# EAGLE design control_prg_03_12_2018 (EAGLE 6.6.0)
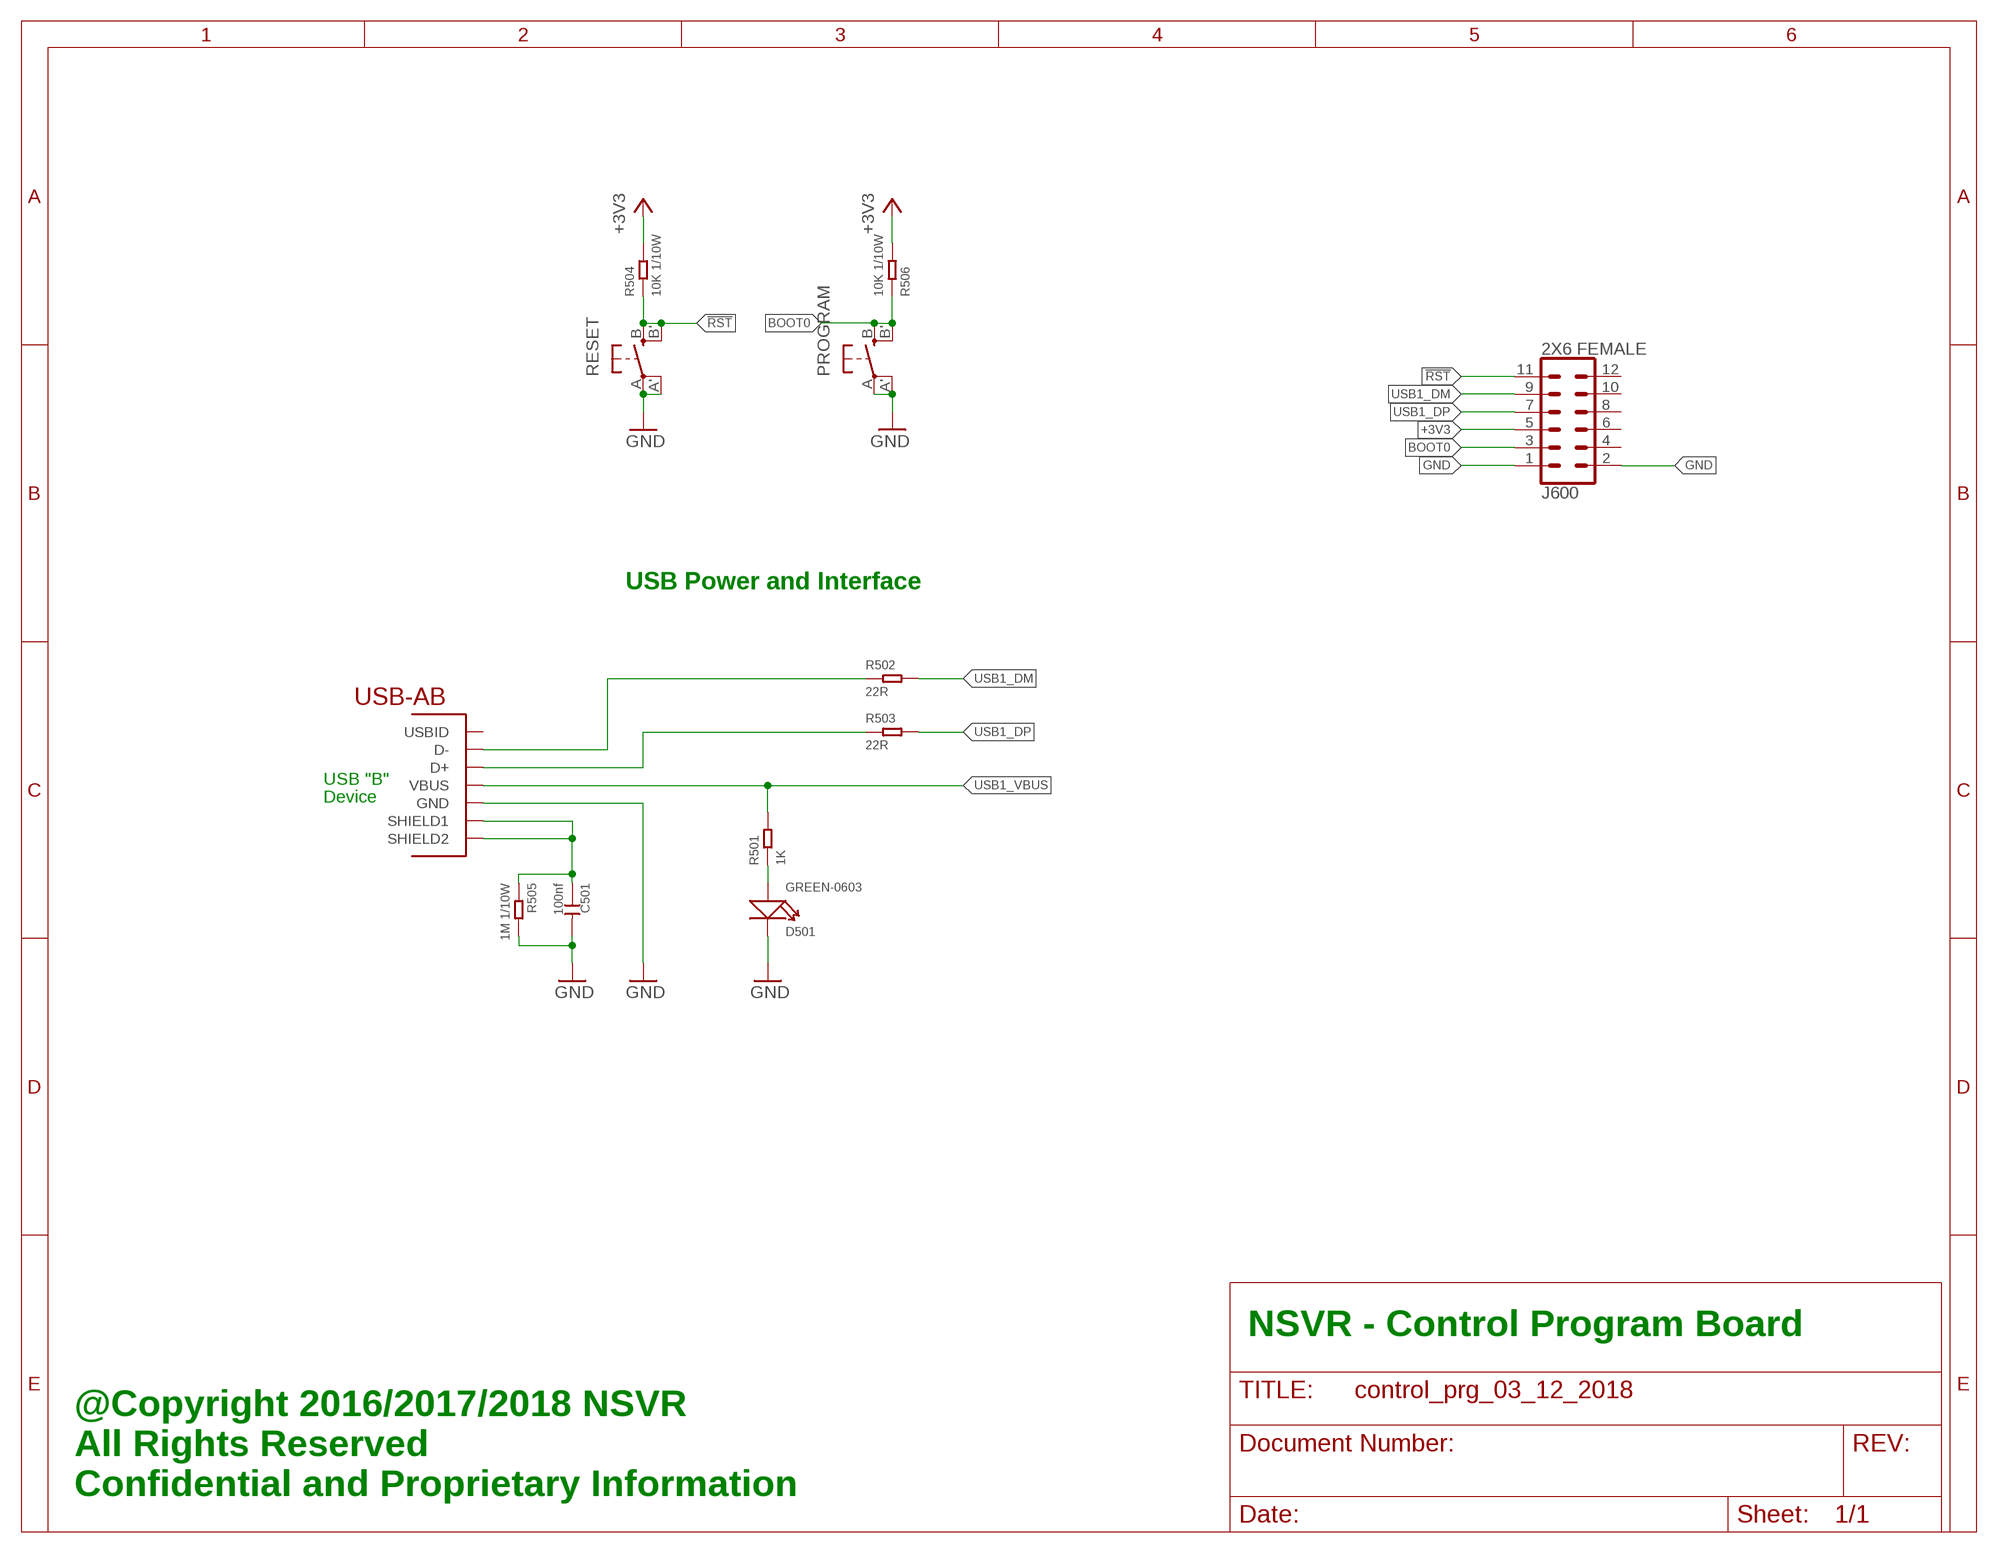
[diagram p0: schematic, sheet 1]

## Parts
C501  100nf  CERAMIC-100NF-50V-10%-X7R(0603)  [C0603]
D501  GREEN-0603  SMD-LED-CLEAR-GREEN(0603)  [LED-0603]
J600  2X6 FEMALE  CONN_06X2PTH_FEMALE  [2X6]
PROGRAM  EVQQ2  [EVQ-Q2]
R501  1K  SMD-RES-1K-1%-1/10W(0603)  [R0603]
R502  22R  SMD-RES-22R-5%-1/10W(0603)  [R0603]
R503  22R  SMD-RES-22R-5%-1/10W(0603)  [R0603]
R504  10K 1/10W  SMD-RES-10K-5%-1/10W(0603)  [R0603]
R505  1M 1/10W  SMD-RES-1M-5%-1/10W(0603)  [R0603]
R506  10K 1/10W  SMD-RES-10K-5%-1/10W(0603)  [R0603]
RESET  EVQQ2  [EVQ-Q2]
USB501  USB_AB  [USB-AB-MICRO-SMD]

## Nets
!RST: J600.11 R504.1 RESET.B'(S1) RESET.B(S)
+3V3: J600.5 R504.2 R506.2
BOOT0: J600.3 PROGRAM.B'(S1) PROGRAM.B(S) R506.1
GND: C501.2 D501.- J600.1 J600.2 PROGRAM.A'(P1) PROGRAM.A(P) R505.2 RESET.A'(P1) RESET.A(P) USB501.GND
LED1: D501.+ R501.1
USB1_DM: J600.9 R502.2
USB1_DP: J600.7 R503.2
USB1_M: R502.1 USB501.D-
USB1_P: R503.1 USB501.D+
USB1_SHIELD: C501.1 R505.1 USB501.SHIELD1 USB501.SHIELD2
USB1_VBUS: R501.2 USB501.VBUS
Unconnected: J600.4 J600.6 J600.8 J600.10 J600.12 USB501.ID(USBID)

## Notes on the sheet
- USB Power and Interface
- USB "B"
- Device
- NSVR - Control Program Board
- @Copyright 2016/2017/2018 NSVR
  All Rights Reserved
  Confidential and Proprietary Information

## Library data of the parts
C501 = Seeed-Capacitor-2016:CERAMIC-100NF-50V-10%-X7R(0603): 302010138; MPN: CC0603KRX7R9BB104
D501 = Seeed-LED-2016:SMD-LED-CLEAR-GREEN(0603): 304090043; MPN: 19-217-G7C-AN1P2-3T
J600 = SparkFun-Connectors:CONN_06X2: Multi connection point. Often used as Generic Header-pin footprint for 0.1 inch spaced/style header connections On any of the 0.1 inch spaced packages, you can populate with these: Break Away Headers - Straight <https://www.sparkfun.com/products/116> (PRT-00116) Break Away Male Headers - Right Angle <https://www.sparkfun.com/products/553> (PRT-00553) Female Headers <https://www.sparkfun.com/products/115> (PRT-00115) Break Away Headers - Machine Pin <https://www.sparkfun.com/products/117> (PRT-00117) Break Away Female Headers - Swiss Machine Pin <https://www.sparkfun.com/products/743> (PRT-00743); PROD_ID: CONN-12423
PROGRAM RESET = adafruit:EVQQ2: SMT 6mm switch, EVQQ2 series http://www.ladyada.net/library/eagle
R501 = Seeed-Resistor-2016:SMD-RES-1K-1%-1/10W(0603): 301010298; MPN: RC0603FR-071KL
R502 R503 = Seeed-Resistor-2016:SMD-RES-22R-5%-1/10W(0603): 301010289; MPN: RC0603JR-0722RL
R504 R506 = Seeed-Resistor-2016:SMD-RES-10K-5%-1/10W(0603): 301010293; MPN: RC0603JR-0710KL
R505 = Seeed-Resistor-2016:SMD-RES-1M-5%-1/10W(0603): 301010100; MPN: RC0603JR-071ML
USB501 = BeeSafe:USB_AB: This is a USB AB connector that is compatible with USB OTG. i.e. this connector can serve as a host or device

## Board
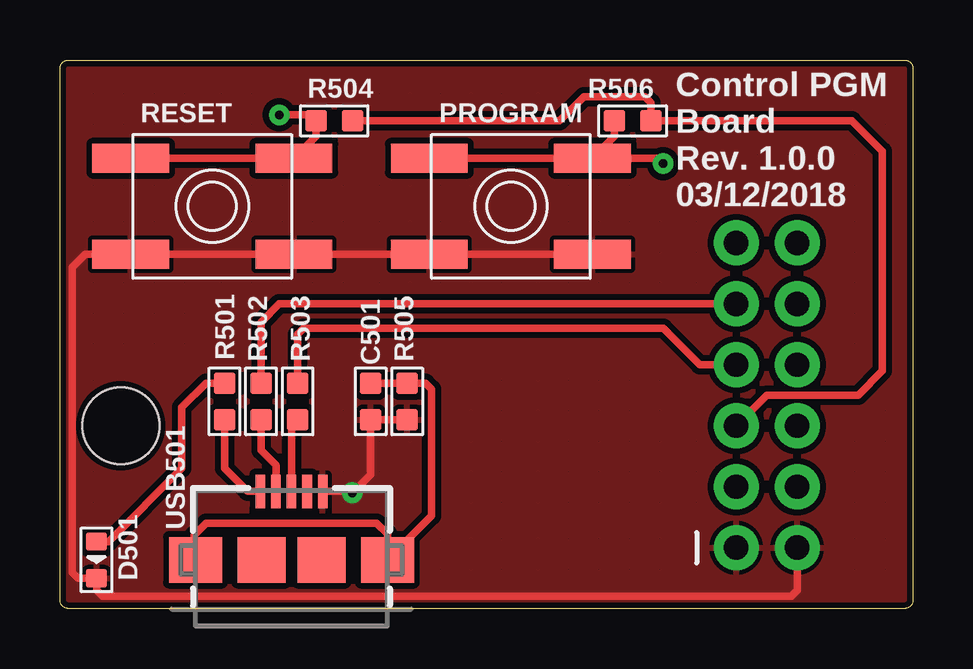
[diagram p1: board, top side]
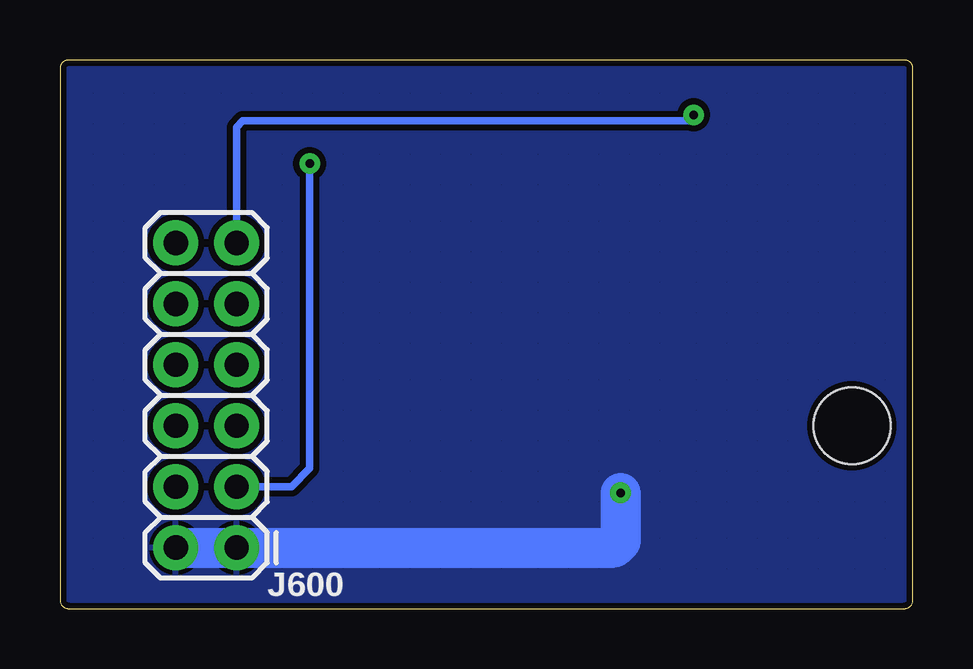
[diagram p2: board, bottom side, seen from below]

Size 35.56 x 22.86 mm. Coordinates in mm from the lower left corner, seen from the top.
Outline: 0,0.36 0,22.5 arc-90 0.36,22.86 35.2,22.86 arc-90 35.56,22.5 35.56,0.36 arc-90 35.2,0 0.36,0 arc-90 0,0.36
Copper layers (1*16): Top 0.035mm / dielectric 1.5mm / Bottom 0.035mm
Design rules "PatternAgents_7mil": minimum track width 7mil, minimum drill 14mil, track to track 7mil, track to pad 7mil, pad to pad 7mil, via to via 7mil, smd to smd 7mil, copper to edge 7mil, drill to drill 7mil, minimum pad ring 12mil, minimum via ring 10mil, stop-mask expansion 4mil, vias tented up to drill 25mil, thermal gap 7mil
Holes 3.2 mm at 2.54,7.62

### Footprints (pad centres in the part's own frame; a part is rotated, then mirrored left to right if it is on the bottom)
C0603 = smd 0.889 x 0.889: 1 0,0.762; 2 0,-0.762
LED-0603 = smd 0.762 x 0.889: + -0.762,0; - 0.762,0
2X6 = drill 1.016 pad 1.88: 1 0,0; 2 0,2.54; 3 2.54,0; 4 2.54,2.54; 5 5.08,0; 6 5.08,2.54; 7 7.62,0; 8 7.62,2.54; 9 10.16,0; 10 10.16,2.54; 11 12.7,0; 12 12.7,2.54
EVQ-Q2 = smd 3.2 x 1.2: A -3.4,-2; A' 3.4,-2; B -3.4,2; B' 3.4,2
R0603 = smd 0.889 x 0.889: 1 0,0.762; 2 0,-0.762
USB-AB-MICRO-SMD = smd 1.4 x 0.4: D+ 2.85,0; D- 2.85,0.65; GND 2.85,-1.3; ID 2.85,-0.65; VBUS 2.85,1.3 | smd 1.9 x 2: P$6 0,1.25; P$7 0,-1.25 | smd 1.9 x 2.2: SHIELD1 0,4; SHIELD2 0,-4

### Placement (x,y rotation side)
C501  12.95,8.64 0 top
D501  1.52,2.03 270 top
J600  28.19,2.54 90 bottom
PROGRAM  18.8,16.76 0 top
R501  6.86,8.64 0 top
R502  8.38,8.64 180 top
R503  9.91,8.64 180 top
R504  11.43,20.32 90 top
R505  14.48,8.64 0 top
R506  23.88,20.32 90 top
RESET  6.35,16.76 0 top
USB501  9.65,2.03 90 top

### Tracks (layer width: path | path; a pad name or v marks a point on that pad's centre or on a via)
!RST  (via drill 0.36)
  Top 0.305: RESET.B RESET.B' 10.67,19.68 R504.1 10.41,20.57 v9.14,20.57
  Bottom 0.305: J600.11 28.19,20.07 27.94,20.32 9.4,20.32 v9.14,20.57
+3V3
  Top 0.305: R504.2 20.83,20.32 21.84,21.34 24.38,21.34 24.64,21.08 R506.2 33.02,20.32 34.29,19.05 34.29,9.91 33.27,8.89 29.46,8.89 J600.5
BOOT0  (via drill 0.36)
  Top 0.305: PROGRAM.B PROGRAM.B' | R506.1 23.11,19.68 PROGRAM.B' | PROGRAM.B' 24.92,18.76 v25.15,18.54
  Bottom 0.305: v25.15,18.54 25.15,5.84 25.91,5.08 J600.3
GND  (via drill 0.36)
  Top 0.305: USB501.GND 12.14,4.88 v12.19,4.83 12.95,5.59 C501.2 R505.2 | J600.2 30.73,0.76 30.48,0.51 1.78,0.51 1.52,0.76 D501.- 0.76,1.27 0.51,1.52 0.51,14.22 1.05,14.76 RESET.A RESET.A' PROGRAM.A PROGRAM.A'
  Bottom 1.676: v12.19,4.83 12.19,2.79 12.45,2.54 J600.1 J600.2
  pour Top (isolate 0.254, hatched): 35.56,0 0,0 0,22.86 35.56,22.86
  pour Bottom (isolate 0.254, hatched): 35.56,0 0,0 0,22.86 35.56,22.86
LED1
  Top 0.305: D501.+ 2.03,2.79 5.08,5.84 5.08,8.38 6.1,9.4 R501.1
USB1_DM
  Top 0.305: J600.9 9.14,12.7 8.38,11.94 R502.2
USB1_DP
  Top 0.305: J600.7 26.67,10.16 25.15,11.68 10.16,11.68 9.91,11.43 R503.2
USB1_M
  Top 0.305: USB501.D- 9,5.98 8.38,6.6 R502.1
USB1_P
  Top 0.305: USB501.D+ 9.65,7.62 R503.1
USB1_SHIELD
  Top 0.305: C501.1 R505.1 15.24,9.4 15.49,9.14 15.49,3.87 USB501.SHIELD2 13.65,3.11 13.21,3.56 6.1,3.56 5.59,3.05 5.59,2.1 USB501.SHIELD1
USB1_VBUS
  Top 0.305: USB501.VBUS 7.82,4.88 6.86,5.84 R501.2

### Text on the board
tPlace: Control PGM / Board / Rev. 1.0.0 / 03/12/2018